# Altium schematic sheet WCH_hairDrierBOTTOM_COM_V1.5.SchDoc
size C; SheetNumber: 1; SheetTotal: 2
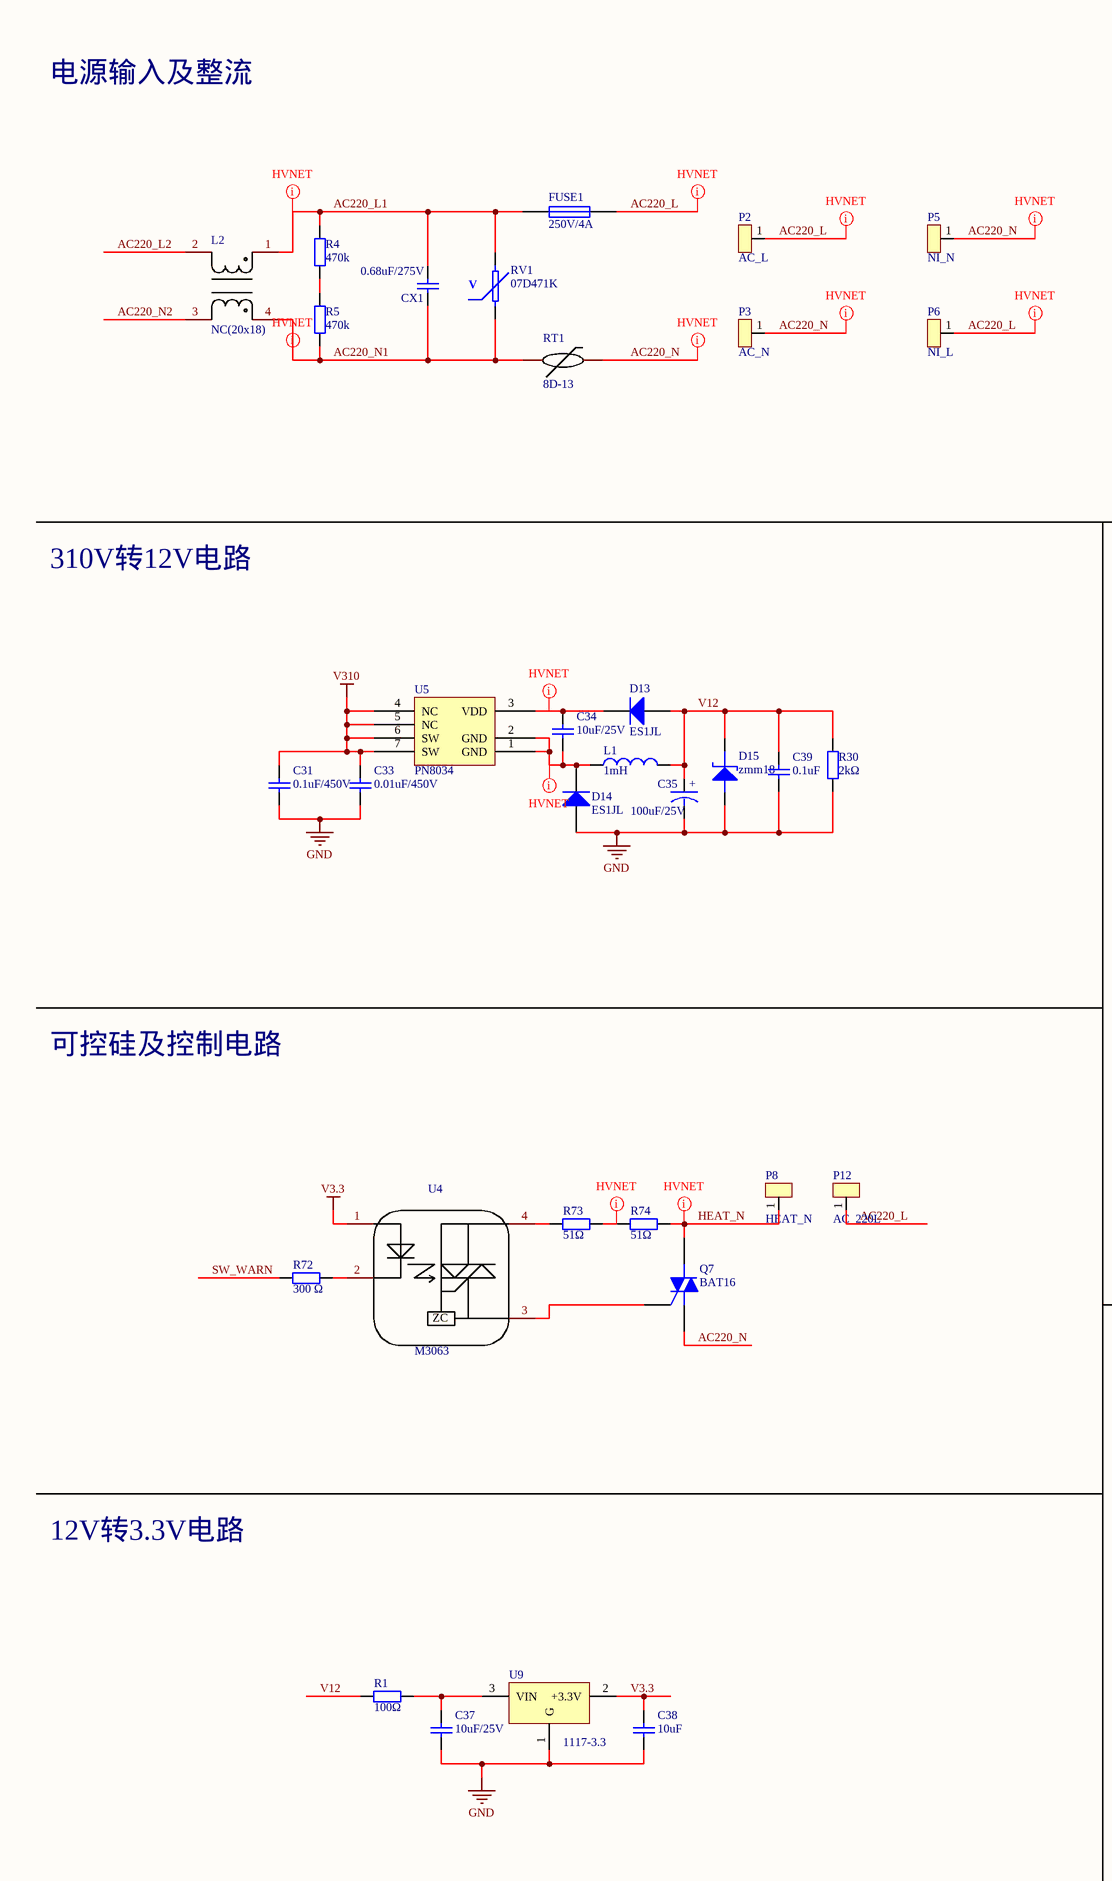
[diagram p0: WCH_hairDrierBOTTOM_COM_V1.5.SchDoc, left]
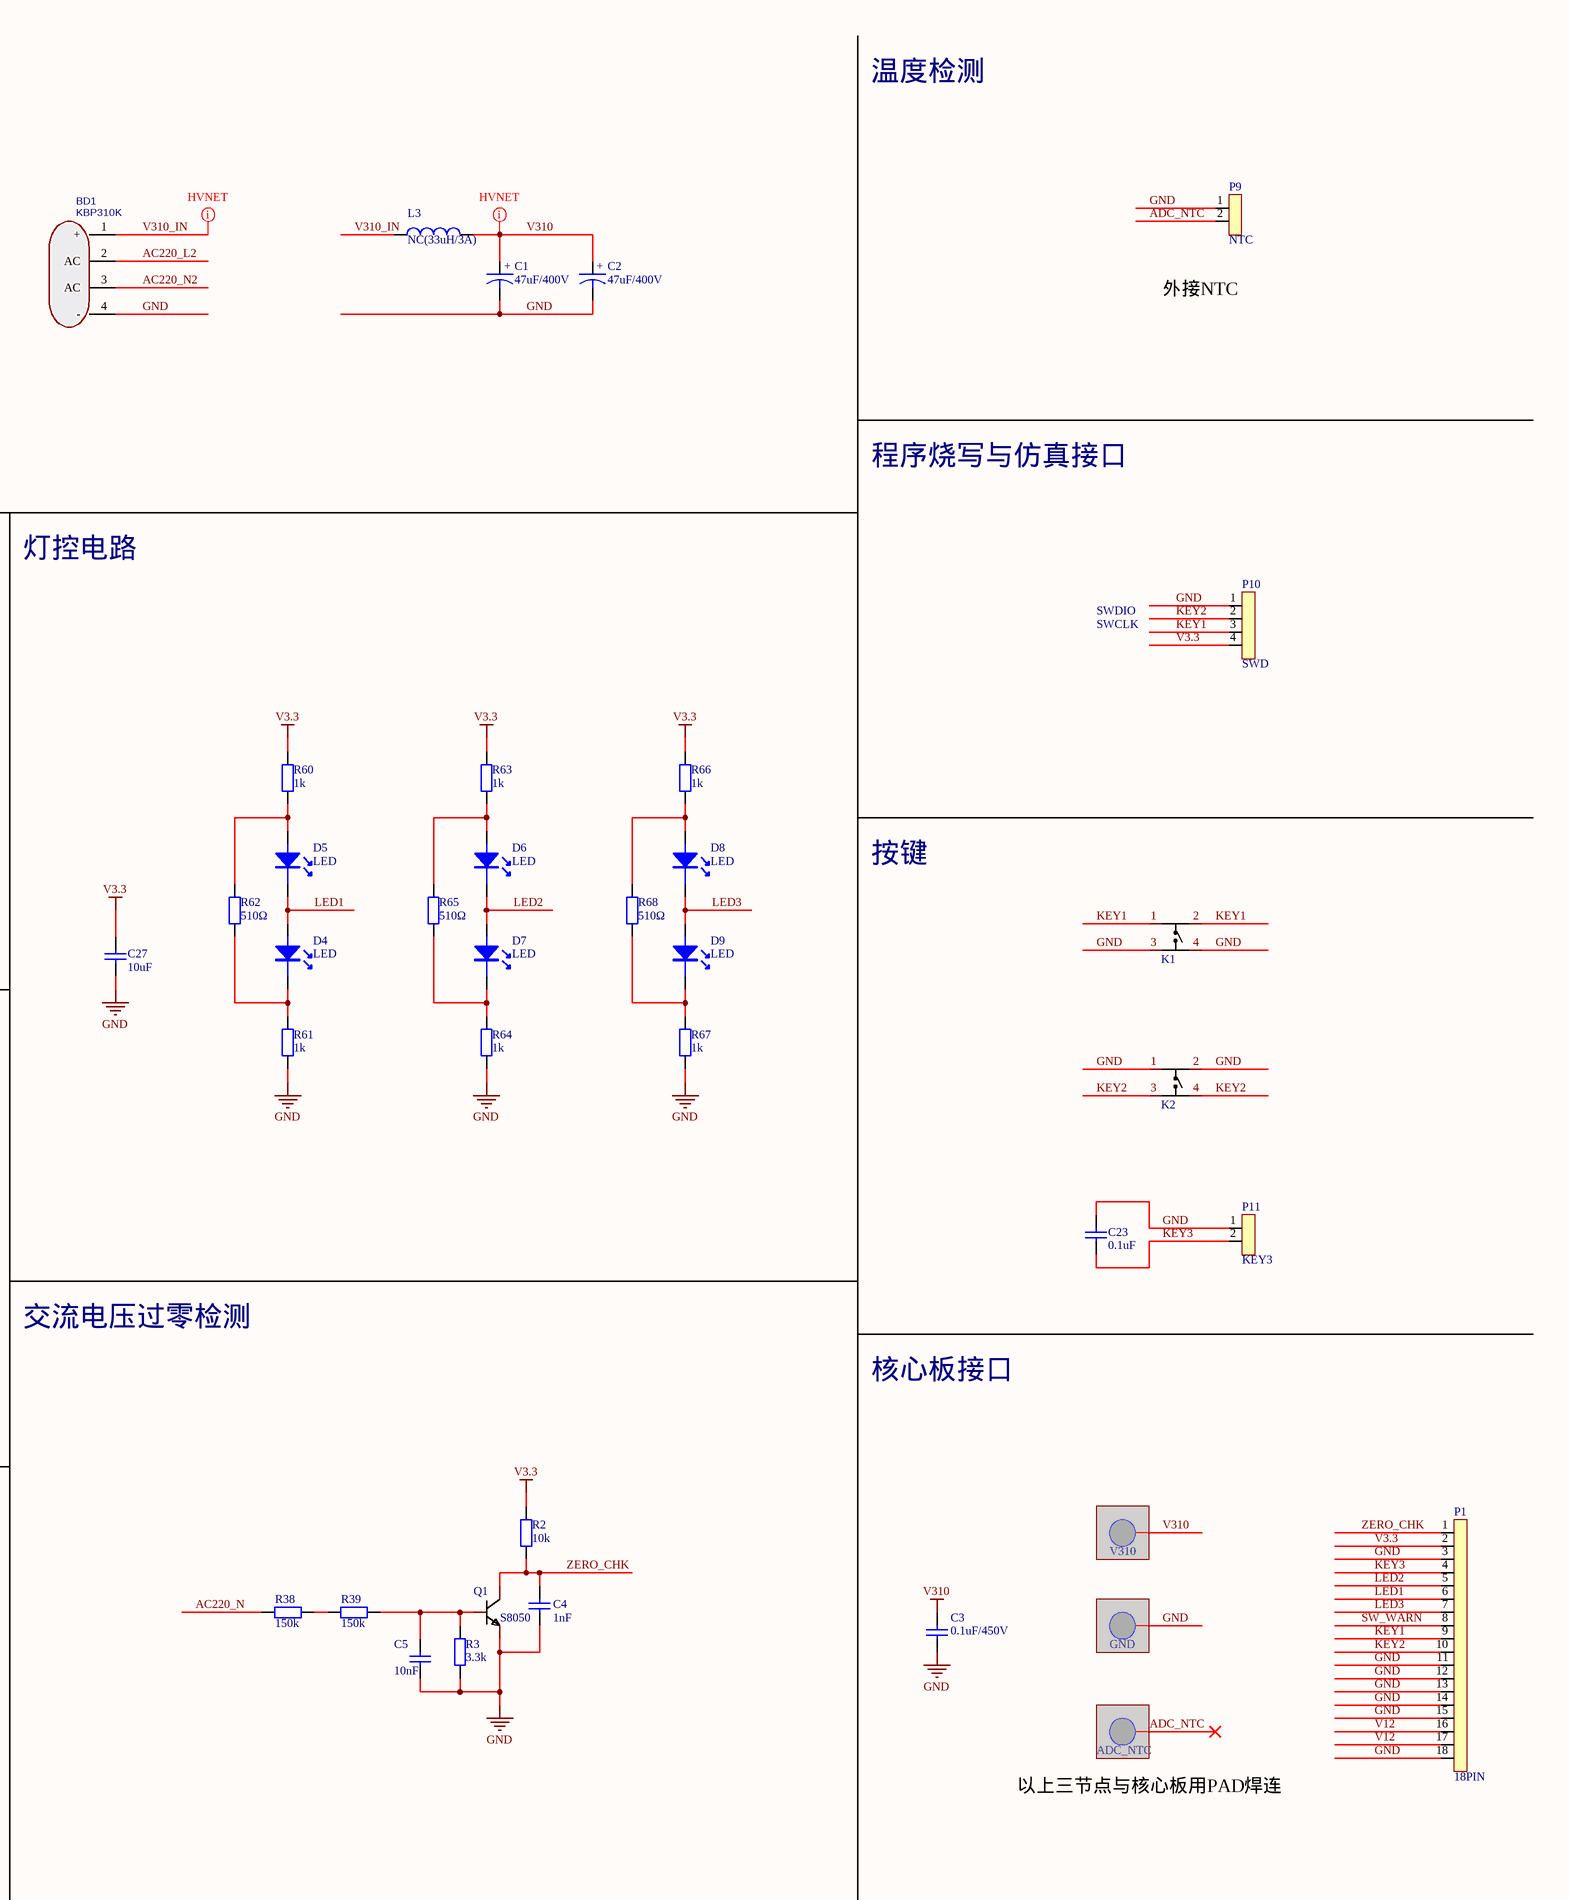
[diagram p1: WCH_hairDrierBOTTOM_COM_V1.5.SchDoc, right]

## Parts
(Parts that share a designator on the sheet are numbered #1, #2 ... from top to bottom, then left to right.)
?#1  V310  (masked out: inside a compile mask, not in the netlist)
?#2  GND  (masked out: inside a compile mask, not in the netlist)
?#3  ADC_NTC  (masked out: inside a compile mask, not in the netlist)
BD1  KBP310K  [3KBP]
C1  47uF/400V  [RB-.2/.4-M]
C2  47uF/400V  [RB-.2/.4-M]
C3  0.1uF/450V  [1206]
C4  1nF  [M_C0402-]
C5  10nF  [M_C0402-]
C23  0.1uF  [M_C0402-]
C27  10uF  [0603C]
C31  0.1uF/450V  [1206]
C33  0.01uF/450V  [1206]
C34  10uF/25V  [0603C]
C35  100uF/25V  [RB-.1/.2]
C37  10uF/25V  [0603C]
C38  10uF  [0603C]
C39  0.1uF  [M_C0402-]
CX1  0.68uF/275V  [CAP-HV-10NF275V-680uf10mm]
D4  LED  [LED-0603]
D5  LED  [LED-0603]
D6  LED  [LED-0603]
D7  LED  [LED-0603]
D8  LED  [LED-0603]
D9  LED  [LED-0603]
D13  ES1JL  [SOD-123]
D14  ES1JL  [SOD-123]
D15  zmm18  [SOD-323]
FUSE1  250V/4A  [FUSE_SMD]
K1  KH-6X6X8H-STM  [KEY2-SMD]  (value not drawn)
K2  KH-6X6X8H-STM  [KEY2-SMD]  (value not drawn)
L1  1mH  [INDUCTOR-5040]
L2  NC(20x18)  [M_COMM_INDUCTOR11*8]
L3  NC(33uH/3A)  [INDUCTOR PCMC063T]
P1  18PIN  [P1.27-18-SMD]
P2  AC_L  [PAD-1.2/2]
P3  AC_N  [PAD-1.2/2]
P5  NI_N  [PAD-1.2/2]
P6  NI_L  [PAD-1.2/2]
P8  HEAT_N  [PAD-1.2/2]
P9  NTC  [GH1.25-2P]
P10  SWD  [2510-4]
P11  KEY3  [GH1.25-2P]
P12  AC_220L  [PAD-1.2/2]
Q1  S8050  [SOT-23]
Q7  BAT16  [M_TO220_2]
R1  100Ω  [1206-]
R2  10k  [M_R0402]
R3  3.3k  [M_R0402]
R4  470k  [1206-]
R5  470k  [1206-]
R30  2kΩ  [0805]
R38  150k  [1206-]
R39  150k  [1206-]
R60  1k  [0603]
R61  1k  [0603]
R62  510Ω  [0603]
R63  1k  [0603]
R64  1k  [0603]
R65  510Ω  [0603]
R66  1k  [0603]
R67  1k  [0603]
R68  510Ω  [0603]
R72  300 Ω  [0603]
R73  51Ω  [1206-]
R74  51Ω  [1206-]
RT1  8D-13  [RT_5D]
RV1  07D471K  [7D391]
U4  M3063  [SOP-4_L3.8-W4.6-H2.0-LS7.0-P2.54]
U5  PN8034  [SOP-7]
U9  1117-3.3  [SOT-89]

## Nets
GND: BD1.4(-) C1.2 C2.2 C3.2 C4.2 C5.2 C23.2 C27.2 C31.2 C33.2 C35.2 C37.2 C38.2 C39.2 D14.1(A) D15.1(A) K1.3(C) K1.4(D) K2.1(A) K2.2(B) P1.3 P1.11 P1.12 P1.13 P1.14 P1.15 P1.18 P9.1 P10.1 P11.1 Q1.2 R3.1 R30.1 R61.2 R64.2 R67.2 U9.1(G)
V3.3: C27.1 C38.1 P1.2 P10.4 R2.1 R60.2 R63.2 R66.2 U4.1 U9.2(+3.3V)
V310: C1.1 C2.1 C3.1 C31.1 C33.1 L3.2 U5.4(NC) U5.5(NC) U5.6(SW) U5.7(SW)
AC220_L: FUSE1.2 P2.1 P6.1 P12.1
AC220_L1: CX1.1 FUSE1.1 L2.1 R4.1 RV1.2
AC220_L2: BD1.2(AC) L2.2
AC220_N: P3.1 P5.1 Q7.1(M1) R38.2 RT1.1
AC220_N1: CX1.2 L2.4 R5.2 RT1.2 RV1.1
AC220_N2: BD1.3(AC) L2.3
ADC_NTC: P9.2
HEAT_N: P8.1 Q7.2(M2) R74.1
KEY1: K1.1(A) K1.2(B) P1.9 P10.3
KEY2: K2.3(C) K2.4(D) P1.10 P10.2
KEY3: C23.1 P1.4 P11.2
LED1: D4.1(A) D5.2(K) P1.6
LED2: D6.2(K) D7.1(A) P1.5
LED3: D8.2(K) D9.1(A) P1.7
SW_WARN: P1.8 R72.2
V12: C35.1 C39.1 D13.1(A) D15.2(K) L1.2 P1.16 P1.17 R1.2 R30.2
V310_IN: BD1.1(+) L3.1
ZERO_CHK: C4.1 P1.1 Q1.3 R2.2
NetC5_1: C5.1 Q1.1 R3.2 R39.1
NetC34_1: C34.1 D13.2(K) U5.3(VDD)
NetC34_2: C34.2 D14.2(K) L1.1 U5.1(GND) U5.2(GND)
NetC37_1: C37.1 R1.1 U9.3(VIN)
NetD4_2: D4.2(K) R61.1 R62.2
NetD5_1: D5.1(A) R60.1 R62.1
NetD6_1: D6.1(A) R63.1 R65.1
NetD7_2: D7.2(K) R64.1 R65.2
NetD8_1: D8.1(A) R66.1 R68.1
NetD9_2: D9.2(K) R67.1 R68.2
NetQ7_3: Q7.3(G) U4.3
NetR4_2: R4.2 R5.1
NetR38_1: R38.1 R39.2
NetR72_1: R72.1 U4.2
NetR73_1: R73.1 R74.2
NetR73_2: R73.2 U4.4

## Layout directives
net class HVNET: AC220_L, AC220_L1, AC220_N, AC220_N1, HEAT_N, NetC34_1, NetC34_2, NetR73_1, V310, V310_IN

## Notes on the sheet
- 电源输入及整流
- 温度检测
- 外接NTC
- 程序烧写与仿真接口
- 310V转12V电路
- 灯控电路
- SWDIO
- SWCLK
- 按键
- 可控硅及控制电路
- 交流电压过零检测
- 核心板接口
- 12V转3.3V电路
- 以上三节点与核心板用PAD焊连
- (in symbol CAPACITOR POL_2) +
- (in symbol FODM3063) ZC
- (in symbol RV) V

## Library data of the parts
?#1-?#3 = VirtualPort
BD1 = KBP310K: BOM_Manufacturer: MDD; BOM_Supplier: LCSC; BOM_Manufacturer Part: KBP310K; BOM_Supplier Part: C2496; BOM_JLCPCB Part Class: Extended Part; spicePre: D; spiceSymbolName: KBP310K
C1 C2 C35 = CAPACITOR POL_2: Capacitor
  C1 C2: Value: 47uF/400V
  C35: Value: 100uF/25V
C3-C5 C23 C27 C31 C33 C34 C37-C39 = Cap Semi: Capacitor (Semiconductor SIM Model); Published: 8-Jun-2000; LatestRevisionDate: 17-Jul-2002; LatestRevisionNote: Re-released for DXP Platform.; PackageReference: C0805; Publisher: Altium Limited
  C3 C31: Value: 0.1uF/450V
  C4: Value: 1nF
  C5: Value: 10nF
  C23 C39: Value: 0.1uF
  C27 C38: Value: 10uF
  C33: Value: 0.01uF/450V
  C34 C37: Value: 10uF/25V
CX1 = Cap: Capacitor; Published: 8-Jun-2000; LatestRevisionDate: 17-Jul-2002; LatestRevisionNote: Re-released for DXP Platform.; Publisher: Altium Limited; Value: 0.68uF/275V
D13 D14 = Diode 1N4148: High Conductance Fast Diode; Published: 8-Jun-2000; LatestRevisionDate: 17-Jul-2002; LatestRevisionNote: Re-released for DXP Platform.; DatasheetDocument: 1997; PackageReference: DO-35; Publisher: Altium Limited; Code_JEDEC: DO-204-AH; ComponentLink1Description: Manufacturer Link; ComponentLink1URL: http://www.fairchildsemi.com/; ComponentLink2Description: Datasheet; ComponentLink2URL: http://www.fairchildsemi.com/ds/1N%2F1N4148.pdf
D15 = DIODE_ZENER
FUSE1 = FUSE
K1 K2 = KH-6X6X8H-STM: Add into BOM: yes; Contact Current: 50mA; Voltage Rating (DC): 12V; Mechanical Life: 80000; Switch Length: 6mm; Name: KH-6X6X8H-STM; Symbol: KH-6X6X8H-STM; Device: KH-6X6X8H-STM; LCSC Part Name: KH-6X6X8H-STM; Supplier Part: C2837534; Manufacturer Part: KH-6X6X8H-STM; Supplier Footprint: SMD; JLCPCB Part Class: Extended Part; Datasheet: https://atta.szlcsc.com/upload/public/pdf/source/20210608/C2837534_94EAC7D8AFBB996E2814FACF50FEEF85.pdf; Supplier: LCSC; Convert to PCB: yes; Voltage Rating (AC): -; Power Rating: -; With Lamp: -; Operating Force: -; Operating Temperature: -; IP Rating: -; Switch Width: 6mm; Switch Height: -
L1 L3 = INDUCTOR
  L1: Value: 1mH
  L3: Value: NC(33uH/3A)
L2 = UU9.8-5mH: Add into BOM: yes; Symbol: UU9.8-5MH; Device: UU9.8-5mH; Supplier Part: C116373; Manufacturer Part: UU9.8-5mH; Supplier Footprint: Through Hole; JLCPCB Part Class: Extended Part; Datasheet: https://atta.szlcsc.com/upload/public/pdf/source/20180308/C116373_15204885408701413779.pdf; Supplier: LCSC; Convert to PCB: yes
P2 P3 P5 P6 P8 P12 = 1PIN: CONNECTOR
P9 P11 = 2PIN
P10 = 4PIN
Q1 = S8050_C105433: Add into BOM: yes; Transistor Type: NPN; Collector-Emitter Breakdown Voltage (Vceo): 25V; Collector Current (Ic): 500mA; Power Dissipation (Pd): 300mW; Collector Cut-Off Current (Icbo): 100nA; Collector-Emitter Saturation Voltage (VCE(sat)@Ic,Ib): 600mV@500mA,50mA; DC Current Gain (hFE@Ic,Vce): 120@50mA,1V; Transition Frequency (fT): 150MHz; Name: S8050; Symbol: S8050_C105433; Device: S8050_C105433; Supplier Part: C105433; Manufacturer Part: S8050; Supplier Footprint: SOT-23; JLCPCB Part Class: Extended Part; Datasheet: https://atta.szlcsc.com/upload/public/pdf/source/20170415/1492237762328.pdf; Supplier: LCSC; Convert to PCB: yes
Q7 = Triac: Silicon Bidirectional Triode Thyristor; Note: Pin 2 is electrically connected to Pin 4 (TAB); Published: 29-Sep-2000; LatestRevisionDate: 17-Jul-2002; LatestRevisionNote: Re-released for DXP Platform.; DatasheetDocument: 1999; PackageReference: 369-03; Publisher: Altium Limited; Code_JEDEC: TO-251-AA; ComponentLink1Description: Manufacturer Link; ComponentLink1URL: http://www.motorola.com/
R1-R5 R30 R38 R39 R60-R68 R72-R74 = Res2: Resistor; Published: 8-Jun-2000; LatestRevisionDate: 17-Jul-2002; LatestRevisionNote: Re-released for DXP Platform.; PackageReference: AXIAL-0.4; Publisher: Altium Limited
  R1: Value: 100Ω
  R2: Value: 10k
  R3: Value: 3.3k
  R4 R5: Value: 470k
  R30: Value: 2kΩ
  R38 R39: Value: 150k
  R60 R61 R63 R64 R66 R67: Value: 1k
  R62 R65 R68: Value: 510Ω
  R72: Value: 300 Ω
  R73 R74: Value: 51Ω
RT1 = NTC 5D-11: Symbol: MF72-5D-11; Add into BOM: yes; Steady State Current (Max): 4A; Device: NTC 5D-11; Supplier Part: C9179; Manufacturer Part: NTC 5D-11; JLCPCB Part Class: Extended Part; Datasheet: https://atta.szlcsc.com/upload/public/pdf/source/20160823/1471947562750.pdf; Supplier: LCSC; Convert to PCB: yes; Resistance Tolerance: -; B Constant Tolerance: -; Power: -
RV1 = RV
U4 = FODM3063: Add into BOM: yes; Symbol: FODM3063; Device: FODM3063; LCSC Part Name: FODM3063; Supplier Part: C891200; Manufacturer Part: FODM3063; Supplier Footprint: Mini-Flat-4; JLCPCB Part Class: Extended Part; Datasheet: https://atta.szlcsc.com/upload/public/pdf/source/20210806/C891200_48E5BDA4CE18C6C5D79106BC56C23B01.pdf; Supplier: LCSC; Convert to PCB: yes
U5 = PN8054